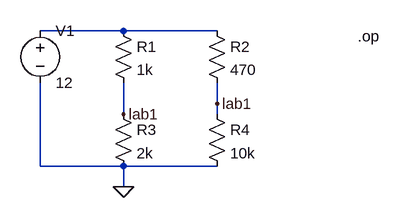
[diagram p0: schematic analisi-statica.asc]
analisi-statica.asc, the LTspice schematic file:
Version 4
SHEET 1 880 680
WIRE 208 144 80 144
WIRE 352 144 208 144
WIRE 352 256 352 224
WIRE 208 272 208 224
WIRE 352 272 352 256
WIRE 80 352 80 224
WIRE 208 352 80 352
WIRE 352 352 208 352
WIRE 208 384 208 352
FLAG 208 384 0
FLAG 208 272 lab1
FLAG 352 256 lab1
DATAFLAG 144 352 "$"
DATAFLAG 304 144 "$"
SYMBOL res 192 128 R0
SYMATTR InstName R1
SYMATTR Value 1k
SYMBOL res 336 128 R0
SYMATTR InstName R2
SYMATTR Value 470
SYMBOL res 192 256 R0
SYMATTR InstName R3
SYMATTR Value 2k
SYMBOL res 336 256 R0
SYMATTR InstName R4
SYMATTR Value 10k
SYMBOL voltage 80 128 R0
SYMATTR InstName V1
SYMATTR Value 12
TEXT 568 152 Left 2 !.op

The netlist it stands for:
* analisi-statica.asc
R1 N001 lab1 1k
R2 N001 lab1 470
R3 lab1 0 2k
R4 lab1 0 10k
V1 N001 0 12
.op
.backanno
.end